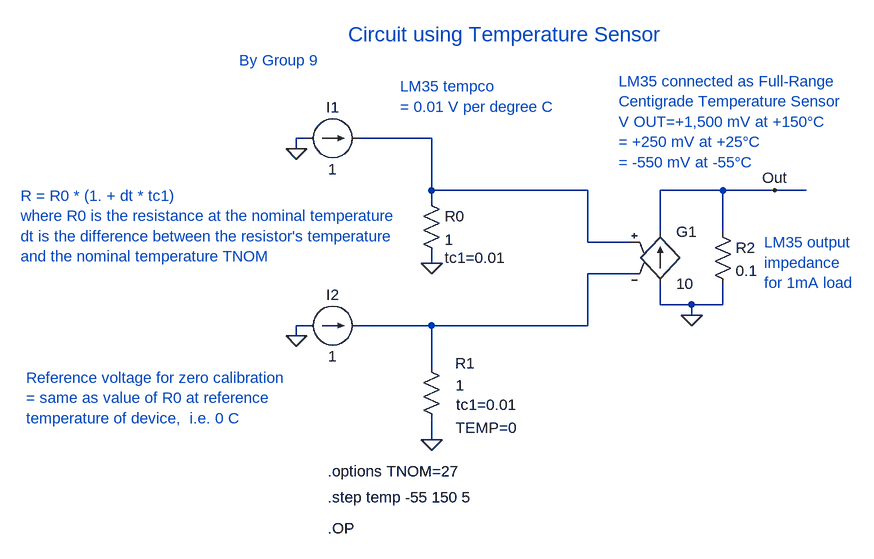
[diagram p0: schematic tmp sensor 2.asc]
tmp sensor 2.asc, the LTspice schematic file:
Version 4
SHEET 1 2344 1864
WIRE 976 1232 960 1232
WIRE 1168 1232 1056 1232
WIRE 960 1248 960 1232
WIRE 1168 1312 1168 1232
WIRE 1408 1312 1168 1312
WIRE 1616 1312 1520 1312
WIRE 1696 1312 1616 1312
WIRE 1744 1312 1696 1312
WIRE 1168 1328 1168 1312
WIRE 1520 1376 1520 1312
WIRE 1616 1376 1616 1312
WIRE 1408 1392 1408 1312
WIRE 1472 1392 1408 1392
WIRE 1168 1424 1168 1408
WIRE 1472 1440 1408 1440
WIRE 1520 1488 1520 1456
WIRE 1568 1488 1520 1488
WIRE 1616 1488 1616 1456
WIRE 1616 1488 1568 1488
WIRE 1568 1504 1568 1488
WIRE 976 1520 960 1520
WIRE 1168 1520 1056 1520
WIRE 1408 1520 1408 1440
WIRE 1408 1520 1168 1520
WIRE 960 1536 960 1520
WIRE 1168 1584 1168 1520
WIRE 1168 1696 1168 1664
FLAG 1696 1312 Out
FLAG 960 1248 0
FLAG 960 1536 0
FLAG 1168 1424 0
FLAG 1168 1696 0
FLAG 1568 1504 0
SYMBOL res 1152 1312 R0
WINDOW 123 36 104 Left 2
SYMATTR Value2 tc1=0.01
SYMATTR InstName R0
SYMATTR Value 1
SYMBOL g 1520 1360 R0
SYMATTR InstName G1
SYMATTR Value 10
SYMBOL res 1600 1360 R0
SYMATTR InstName R2
SYMATTR Value 0.1
SYMBOL current 976 1232 R270
WINDOW 0 32 40 VTop 2
WINDOW 3 -32 40 VBottom 2
SYMATTR InstName I1
SYMATTR Value 1
SYMBOL res 1152 1568 R0
WINDOW 123 54 74 Left 2
WINDOW 0 52 10 Left 2
WINDOW 3 53 44 Left 2
WINDOW 39 53 109 Left 2
SYMATTR Value2 tc1=0.01
SYMATTR InstName R1
SYMATTR Value 1
SYMATTR SpiceLine TEMP=0
SYMBOL current 976 1520 R270
WINDOW 0 32 40 VTop 2
WINDOW 3 -32 40 VBottom 2
SYMATTR InstName I2
SYMATTR Value 1
TEXT 1008 1784 Left 2 !.step temp -55 150 5
TEXT 1008 1744 Left 2 !.options TNOM=27
TEXT 544 1600 Left 2 ;Reference voltage for zero calibration\n= same as value of R0 at reference\ntemperature of device,  i.e. 0 C
TEXT 536 1320 Left 2 ;R = R0 * (1. + dt * tc1)\nwhere R0 is the resistance at the nominal temperature\ndt is the difference between the resistor's temperature\nand the nominal temperature TNOM
TEXT 1456 1144 Left 2 ;LM35 connected as Full-Range \nCentigrade Temperature Sensor\nV OUT=+1,500 mV at +150°C\n= +250 mV at +25°C\n= -550 mV at -55°C
TEXT 1680 1392 Left 2 ;LM35 output\nimpedance\nfor 1mA load
TEXT 1008 1832 Left 2 !.OP
TEXT 1120 1152 Left 2 ;LM35 tempco\n= 0.01 V per degree C
TEXT 1040 1072 Left 3 ;Circuit using Temperature Sensor
TEXT 872 1112 Left 2 ;By Group 9

The netlist it stands for:
* tmp sensor 2.asc
R0 N001 0 1 tc1=0.01
G1 0 Out N001 N002 10
R2 Out 0 0.1
I1 0 N001 1
R1 N002 0 1 tc1=0.01 TEMP=0
I2 0 N002 1
.step temp -55 150 5
.options TNOM=27
* Reference voltage for zero calibration
* = same as value of R0 at reference
* temperature of device,  i.e. 0 C
* R = R0 * (1. + dt * tc1)
* where R0 is the resistance at the nominal temperature
* dt is the difference between the resistor's temperature
* and the nominal temperature TNOM
* LM35 connected as Full-Range
* Centigrade Temperature Sensor
* V OUT=+1,500 mV at +150°C
* = +250 mV at +25°C
* = -550 mV at -55°C
* LM35 output
* impedance
* for 1mA load
.OP
* LM35 tempco
* = 0.01 V per degree C
* Circuit using Temperature Sensor
* By Group 9
.backanno
.end